# Altium schematic sheet LINK_PIC.SchDoc
size A
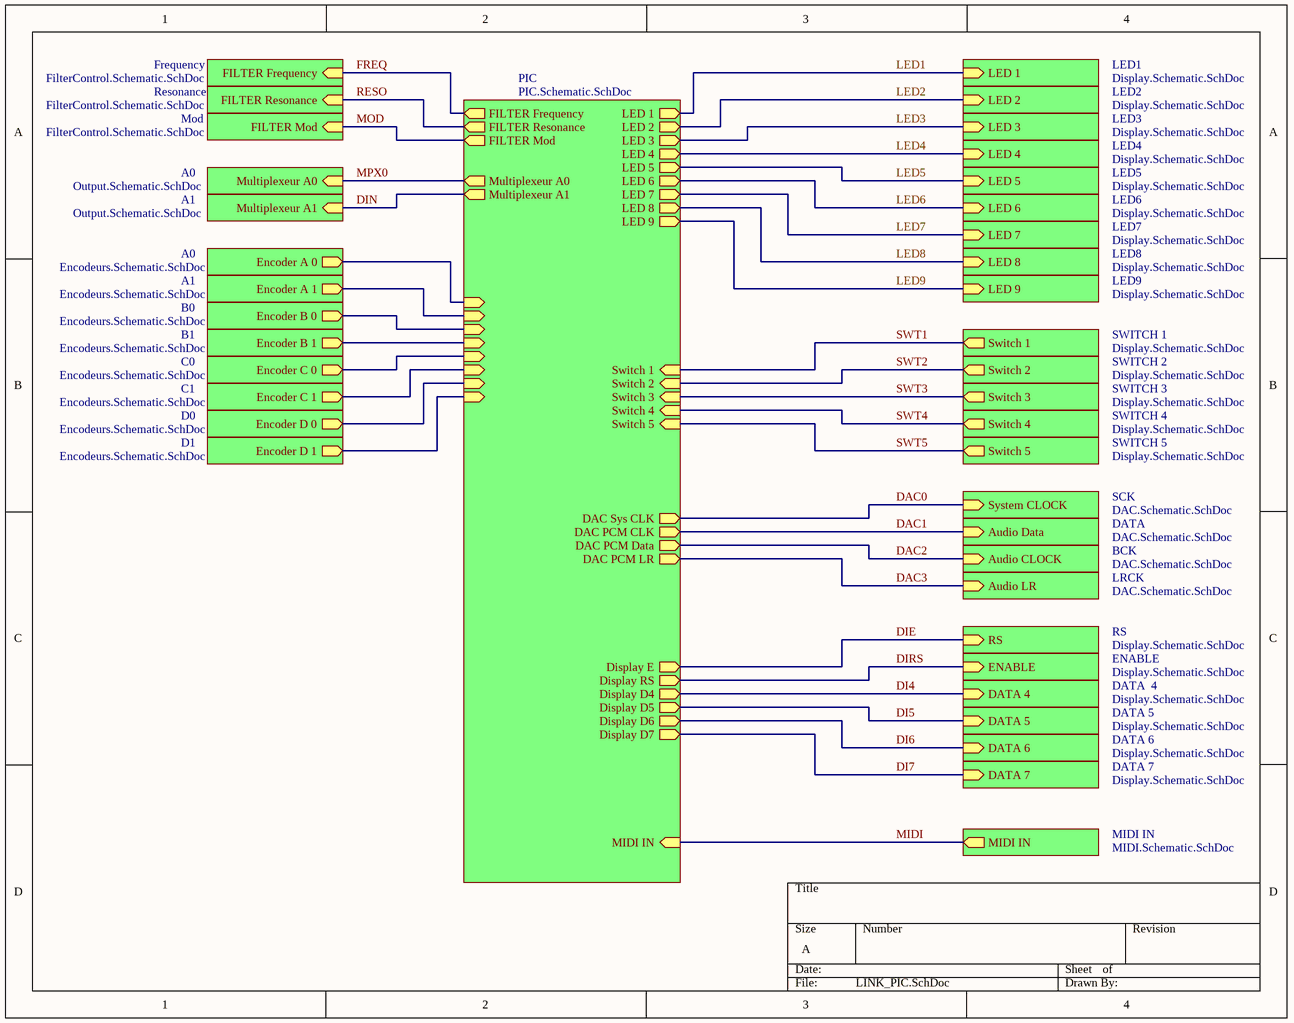
[diagram p0: LINK_PIC.SchDoc]

## Sub-sheets
A0 = Output.Schematic.SchDoc: Multiplexeur A0 (in)
A0 = Encodeurs.Schematic.SchDoc: Encoder A 0 (out)
A1 = Output.Schematic.SchDoc: Multiplexeur A1 (in)
A1 = Encodeurs.Schematic.SchDoc: Encoder A 1 (out)
B0 = Encodeurs.Schematic.SchDoc: Encoder B 0 (out)
B1 = Encodeurs.Schematic.SchDoc: Encoder B 1 (out)
BCK = DAC.Schematic.SchDoc: Audio CLOCK (in)
C0 = Encodeurs.Schematic.SchDoc: Encoder C 0 (out)
C1 = Encodeurs.Schematic.SchDoc: Encoder C 1 (out)
D0 = Encodeurs.Schematic.SchDoc: Encoder D 0 (out)
D1 = Encodeurs.Schematic.SchDoc: Encoder D 1 (out)
DATA = DAC.Schematic.SchDoc: Audio Data (in)
DATA 5 = Display.Schematic.SchDoc: DATA 5 (in)
DATA 6 = Display.Schematic.SchDoc: DATA 6 (in)
DATA 7 = Display.Schematic.SchDoc: DATA 7 (in)
DATA  4 = Display.Schematic.SchDoc: DATA 4 (in)
ENABLE = Display.Schematic.SchDoc: ENABLE (in)
Frequency = FilterControl.Schematic.SchDoc: FILTER Frequency (in)
LED1 = Display.Schematic.SchDoc: LED 1 (in)
LED2 = Display.Schematic.SchDoc: LED 2 (in)
LED3 = Display.Schematic.SchDoc: LED 3 (in)
LED4 = Display.Schematic.SchDoc: LED 4 (in)
LED5 = Display.Schematic.SchDoc: LED 5 (in)
LED6 = Display.Schematic.SchDoc: LED 6 (in)
LED7 = Display.Schematic.SchDoc: LED 7 (in)
LED8 = Display.Schematic.SchDoc: LED 8 (in)
LED9 = Display.Schematic.SchDoc: LED 9 (in)
LRCK = DAC.Schematic.SchDoc: Audio LR (in)
MIDI IN = MIDI.Schematic.SchDoc: MIDI IN (out)
Mod = FilterControl.Schematic.SchDoc: FILTER Mod (in)
PIC = PIC.Schematic.SchDoc: LED 2 (out), LED 1 (out), LED 4 (out), LED 3 (out), LED 6 (out), LED 5 (out), LED 8 (out), LED 7 (out), LED 9 (out), DAC Sys CLK (out), DAC PCM CLK (out), DAC PCM Data (out), DAC PCM LR (out), Switch 1 (in), Switch 2 (in), Switch 3 (in), Switch 4 (in), Switch 5 (in), Display D4 (out), Display D5 (out), Display D6 (out), Display D7 (out), Display E (out), Display RS (out), MIDI IN (in), FILTER Frequency (out), FILTER Resonance (out), FILTER Mod (out), Multiplexeur A0 (out), Multiplexeur A1 (out),  (in),  (in),  (in),  (in),  (in),  (in),  (in),  (in)
Resonance = FilterControl.Schematic.SchDoc: FILTER Resonance (in)
RS = Display.Schematic.SchDoc: RS (in)
SCK = DAC.Schematic.SchDoc: System CLOCK (in)
SWITCH 1 = Display.Schematic.SchDoc: Switch 1 (out)
SWITCH 2 = Display.Schematic.SchDoc: Switch 2 (out)
SWITCH 3 = Display.Schematic.SchDoc: Switch 3 (out)
SWITCH 4 = Display.Schematic.SchDoc: Switch 4 (out)
SWITCH 5 = Display.Schematic.SchDoc: Switch 5 (out)

## Nets
DAC0: sheet PIC/DAC Sys CLK, sheet SCK/System CLOCK
DAC1: sheet PIC/DAC PCM CLK, sheet DATA/Audio Data
DAC2: sheet PIC/DAC PCM Data, sheet BCK/Audio CLOCK
DAC3: sheet PIC/DAC PCM LR, sheet LRCK/Audio LR
DI4: sheet PIC/Display D4, sheet DATA  4/DATA 4
DI5: sheet PIC/Display D5, sheet DATA 5/DATA 5
DI6: sheet PIC/Display D6, sheet DATA 6/DATA 6
DI7: sheet PIC/Display D7, sheet DATA 7/DATA 7
DIE: sheet PIC/Display E, sheet RS/RS
DIN: sheet PIC/Multiplexeur A1, sheet A1/Multiplexeur A1
DIRS: sheet PIC/Display RS, sheet ENABLE/ENABLE
FREQ: sheet PIC/FILTER Frequency, sheet Frequency/FILTER Frequency
LED1: sheet PIC/LED 1, sheet LED1/LED 1
LED2: sheet PIC/LED 2, sheet LED2/LED 2
LED3: sheet PIC/LED 3, sheet LED3/LED 3
LED4: sheet PIC/LED 4, sheet LED4/LED 4
LED5: sheet PIC/LED 5, sheet LED5/LED 5
LED6: sheet PIC/LED 6, sheet LED6/LED 6
LED7: sheet PIC/LED 7, sheet LED7/LED 7
LED8: sheet PIC/LED 8, sheet LED8/LED 8
LED9: sheet PIC/LED 9, sheet LED9/LED 9
MIDI: sheet PIC/MIDI IN, sheet MIDI IN/MIDI IN
MOD: sheet PIC/FILTER Mod, sheet Mod/FILTER Mod
MPX0: sheet PIC/Multiplexeur A0, sheet A0/Multiplexeur A0
RESO: sheet PIC/FILTER Resonance, sheet Resonance/FILTER Resonance
SWT1: sheet PIC/Switch 1, sheet SWITCH 1/Switch 1
SWT2: sheet PIC/Switch 2, sheet SWITCH 2/Switch 2
SWT3: sheet PIC/Switch 3, sheet SWITCH 3/Switch 3
SWT4: sheet PIC/Switch 4, sheet SWITCH 4/Switch 4
SWT5: sheet PIC/Switch 5, sheet SWITCH 5/Switch 5
(unnamed): sheet PIC/, sheet B0/Encoder B 0
(unnamed): sheet PIC/, sheet B1/Encoder B 1
(unnamed): sheet PIC/, sheet A0/Encoder A 0
(unnamed): sheet PIC/, sheet A1/Encoder A 1
(unnamed): sheet PIC/, sheet D0/Encoder D 0
(unnamed): sheet PIC/, sheet D1/Encoder D 1
(unnamed): sheet PIC/, sheet C0/Encoder C 0
(unnamed): sheet PIC/, sheet C1/Encoder C 1